# Altium schematic sheet [02]-STM32F030C8T6.SchDoc
size A; SheetNumber: 2; SheetTotal: 2
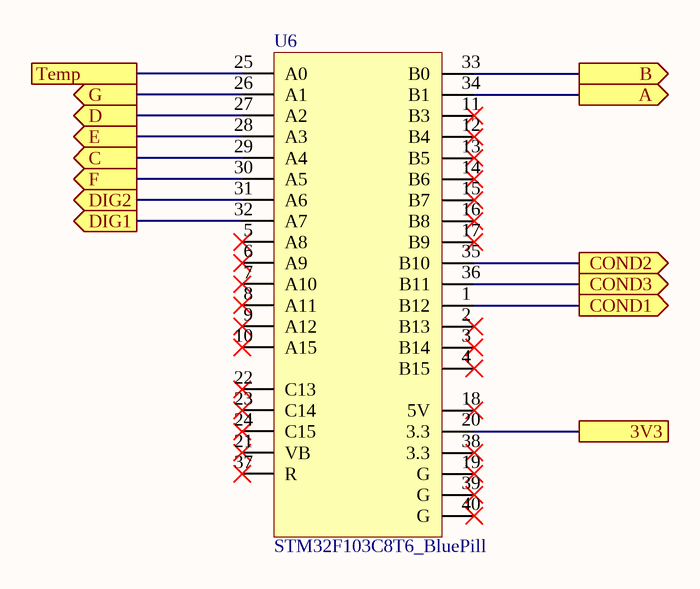
[diagram p0: [02]-STM32F030C8T6.SchDoc]

## Parts
U6  STM32F103C8T6_BluePill  [STM32F103C8T6_BluePill]

## Ports
3V3, A (out), B (out), C (out), COND1 (out), COND2 (out), COND3 (out), D (out), DIG1 (out), DIG2 (out), E (out), F (out), G (out), Temp

## Nets
3V3: U6.20(3.3) ; port 3V3
A: U6.34(B1) ; port A
B: U6.33(B0) ; port B
C: U6.29(A4) ; port C
COND1: U6.1(B12) ; port COND1
COND2: U6.35(B10) ; port COND2
COND3: U6.36(B11) ; port COND3
D: U6.27(A2) ; port D
DIG1: U6.32(A7) ; port DIG1
DIG2: U6.31(A6) ; port DIG2
E: U6.28(A3) ; port E
F: U6.30(A5) ; port F
G: U6.26(A1) ; port G
Temp: U6.25(A0) ; port Temp

Not connected (* = marked no-connect by the designer): U6 2(B13)* 3(B14)* 4(B15)* 5(A8)* 6(A9)* 7(A10)* 8(A11)* 9(A12)* 10(A15)* 11(B3)* 12(B4)* 13(B5)* 14(B6)* 15(B7)* 16(B8)* 17(B9)* 18(5V)* 19(G)* 21(VB)* 22(C13)* 23(C14)* 24(C15)* 37(R)* 38(3.3)* 39(G)* 40(G)*

## Library data of the parts
U6 = STM32F103C8T6_BluePill: STM32F103C8T6 BluePill